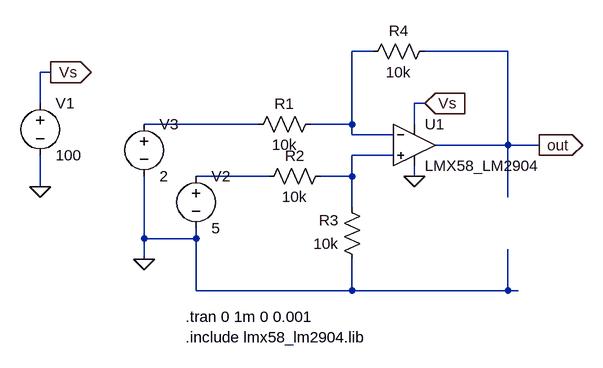
[diagram p0: schematic Stage03_TB_LM358.asc]
Stage03_TB_LM358.asc, the LTspice schematic file:
Version 4.1
SHEET 1 880 680
WIRE 288 48 256 48
WIRE 496 48 368 48
WIRE -208 80 -224 80
WIRE -224 128 -224 80
WIRE 368 128 352 128
WIRE 112 160 -64 160
WIRE 256 160 256 48
WIRE 256 160 192 160
WIRE 352 160 352 128
WIRE 256 176 256 160
WIRE 320 176 256 176
WIRE 496 192 496 48
WIRE 496 192 384 192
WIRE 544 192 496 192
WIRE 320 208 256 208
WIRE 128 240 16 240
WIRE 256 240 256 208
WIRE 256 240 208 240
WIRE 352 240 352 224
WIRE -224 256 -224 208
WIRE 496 272 496 192
WIRE 256 288 256 240
WIRE -64 336 -64 240
WIRE 16 336 16 320
WIRE 16 336 -64 336
WIRE -64 368 -64 336
WIRE 16 416 16 336
WIRE 256 416 256 368
WIRE 256 416 16 416
WIRE 496 416 496 352
WIRE 496 416 256 416
WIRE 512 416 496 416
FLAG -224 256 0
FLAG -208 80 Vs
IOPIN -208 80 Out
FLAG 368 128 Vs
IOPIN 368 128 In
FLAG 352 240 0
FLAG -64 368 0
FLAG 544 192 out
IOPIN 544 192 Out
SYMBOL OpAmps\\opamp2 352 128 R0
SYMATTR InstName U1
SYMATTR Value LMX58_LM2904
SYMBOL voltage -224 112 R0
SYMATTR InstName V1
SYMATTR Value 100
SYMBOL voltage 16 224 R0
SYMATTR InstName V2
SYMATTR Value 5
SYMBOL voltage -64 144 R0
SYMATTR InstName V3
SYMATTR Value 2
SYMBOL res 208 144 R90
WINDOW 0 0 56 VBottom 2
WINDOW 3 32 56 VTop 2
SYMATTR InstName R1
SYMATTR Value 10k
SYMBOL res 224 224 R90
WINDOW 0 0 56 VBottom 2
WINDOW 3 32 56 VTop 2
SYMATTR InstName R2
SYMATTR Value 10k
SYMBOL res 272 384 R180
WINDOW 0 36 76 Left 2
WINDOW 3 36 40 Left 2
SYMATTR InstName R3
SYMATTR Value 10k
SYMBOL res 384 32 R90
WINDOW 0 0 56 VBottom 2
WINDOW 3 32 56 VTop 2
SYMATTR InstName R4
SYMATTR Value 10k
TEXT 0 456 Left 2 !.tran 0 1m 0 0.001
TEXT 0 488 Left 2 !.include lmx58_lm2904.lib

The netlist it stands for:
* Stage03_TB_LM358.asc
X§U1 N003 N001 Vs 0 out LMX58_LM2904  ; pins In+ In- V+ V- OUT
V1 Vs 0 100
V2 N004 0 5
V3 N002 0 2
R1 N001 N002 10k
R2 N003 N004 10k
R3 0 N003 10k
R4 out N001 10k
.tran 0 1m 0 0.001
.include lmx58_lm2904.lib
.backanno
.end